# EAGLE design ModuleCarrier-ISM4334X-M4G-L44 (EAGLE 7.7.0)

## Sheet 1 of 2
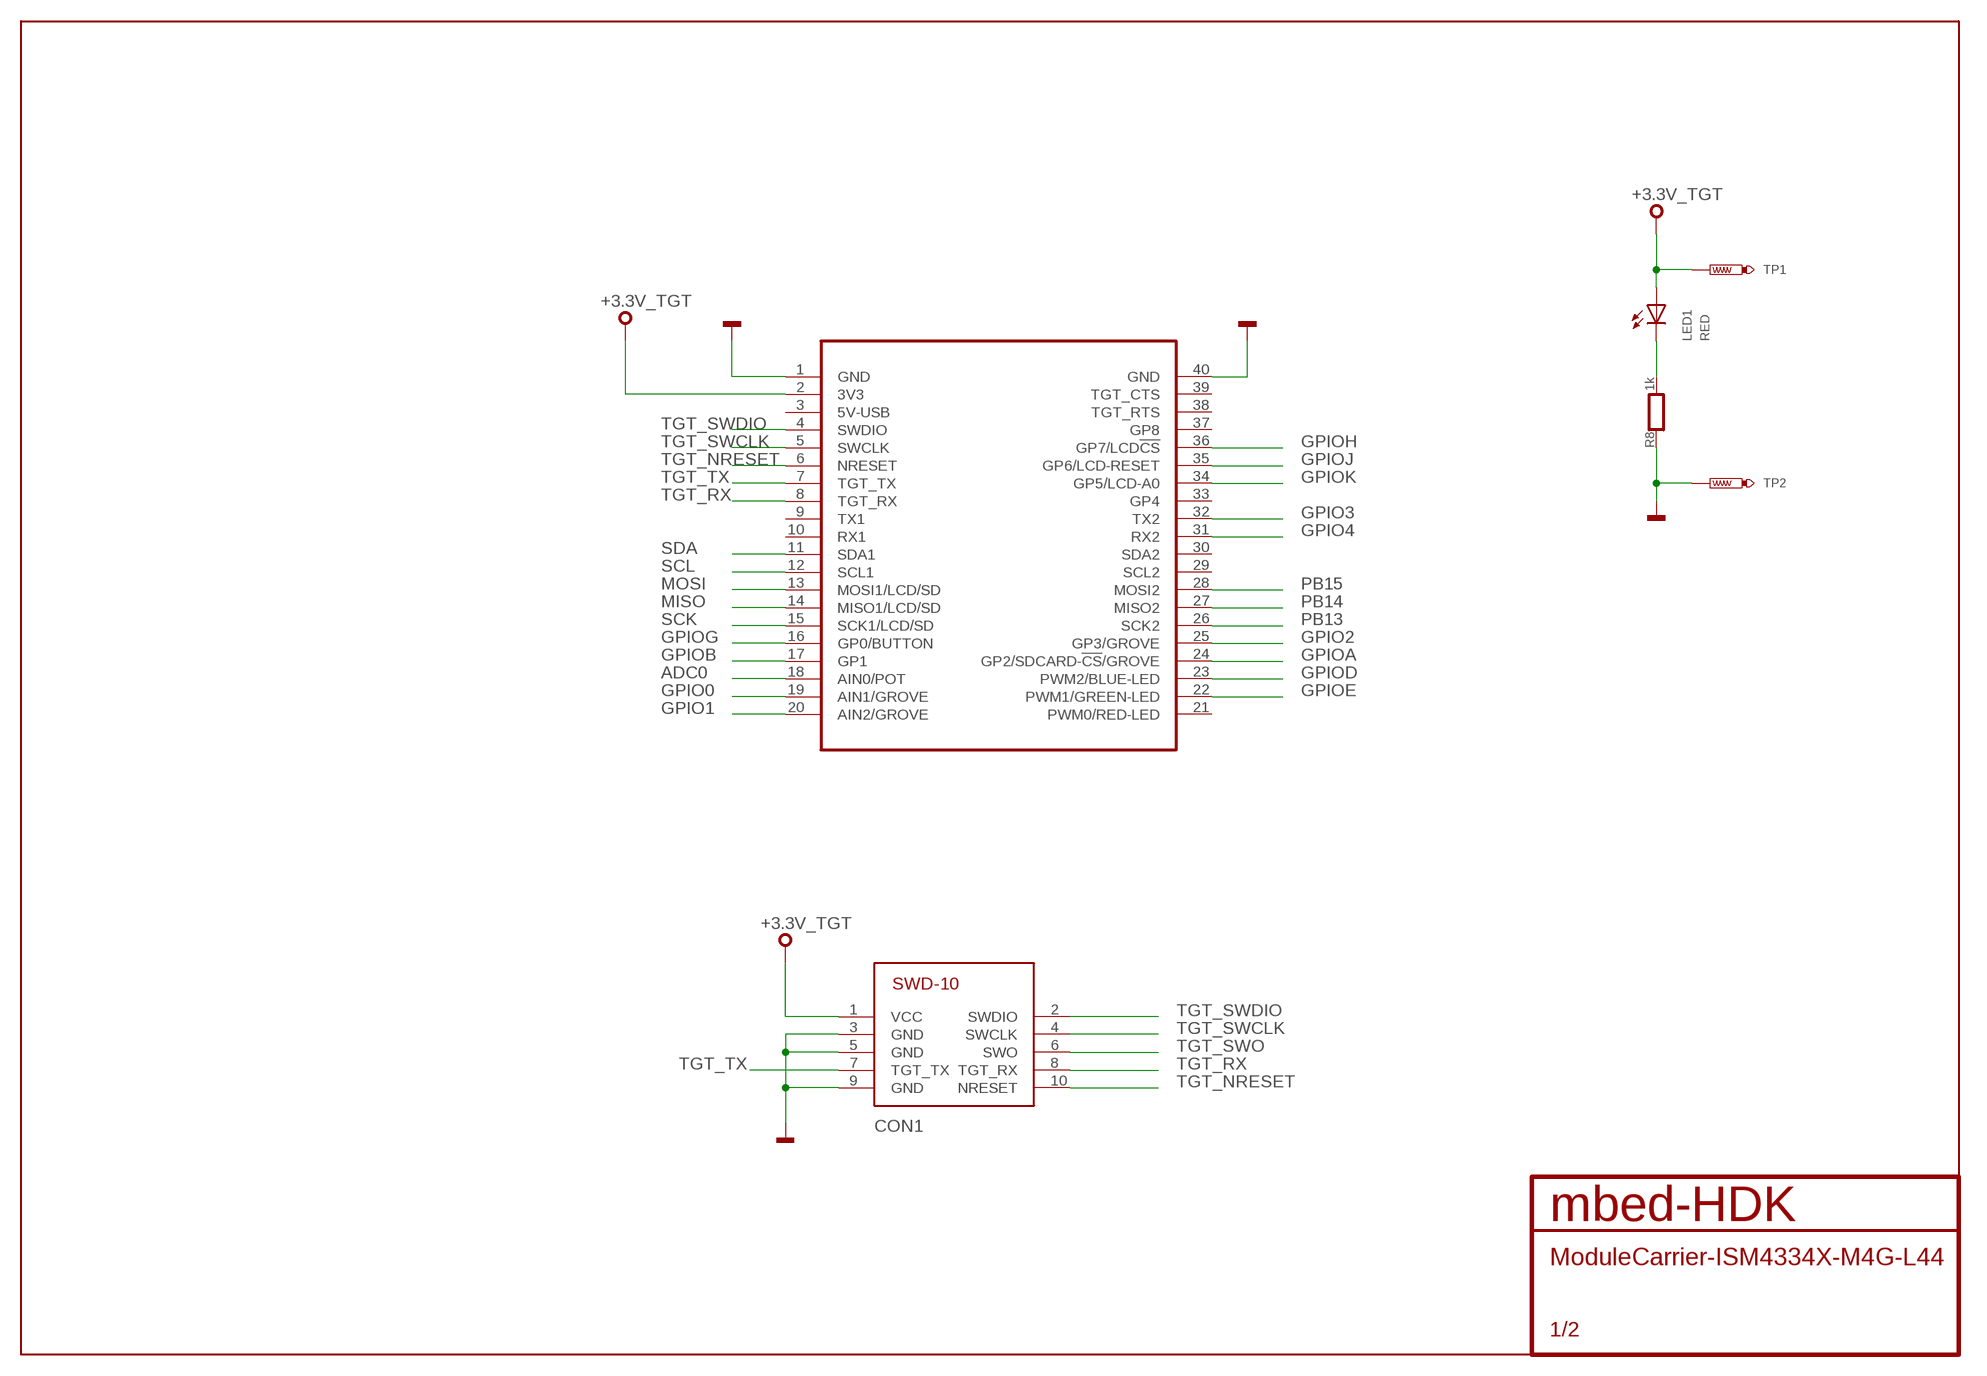
[diagram p0: schematic, sheet 1]

### Parts
CON1  SWD-10/TC2050_SMD  [FTSH-105-02]
LED1  RED  SMD_LED0603  [CHIPLED_0603]
MOD2  MODULE_DAUGHTER  [MODULE_DAUGHTER]
R8  1k  RESISTOR0603  [0603]
TP1  TEST-POINT-50R-PTH  [TP50-PTH]
TP2  TEST-POINT-50R-PTH  [TP50-PTH]

### Nets
+3.3V_TGT: CON1.1(VCC) LED1.A MOD2.2(3V3) TP1.TP ; also sheet 2
ADC0: MOD2.18(AIN0/POT) ; also sheet 2
GND: CON1.3(GND) CON1.5(GND) CON1.9(GND) MOD2.1(GND) MOD2.40(GND) R8.1 TP2.TP ; also sheet 2
GPIO0: MOD2.19(AIN1/GROVE) ; also sheet 2
GPIO1: MOD2.20(AIN2/GROVE) ; also sheet 2
GPIO2: MOD2.25(GP3/GROVE) ; also sheet 2
GPIO3: MOD2.32(TX2) ; also sheet 2
GPIO4: MOD2.31(RX2) ; also sheet 2
GPIOA: MOD2.24(GP2/SDCARD-!CS!/GROVE) ; also sheet 2
GPIOB: MOD2.17(GP1) ; also sheet 2
GPIOD: MOD2.23(PWM2/BLUE-LED) ; also sheet 2
GPIOE: MOD2.22(PWM1/GREEN-LED) ; also sheet 2
GPIOG: MOD2.16(GP0/BUTTON) ; also sheet 2
GPIOH: MOD2.36(GP7/LCD!CS) ; also sheet 2
GPIOJ: MOD2.35(GP6/LCD-RESET) ; also sheet 2
GPIOK: MOD2.34(GP5/LCD-A0) ; also sheet 2
MISO: MOD2.14(MISO1/LCD/SD) ; also sheet 2
MOSI: MOD2.13(MOSI1/LCD/SD) ; also sheet 2
PA_1: LED1.C R8.2
PB13: MOD2.26(SCK2) ; also sheet 2
PB14: MOD2.27(MISO2) ; also sheet 2
PB15: MOD2.28(MOSI2) ; also sheet 2
SCK: MOD2.15(SCK1/LCD/SD) ; also sheet 2
SCL: MOD2.12(SCL1) ; also sheet 2
SDA: MOD2.11(SDA1) ; also sheet 2
TGT_NRESET: CON1.10(NRESET) MOD2.6(NRESET) ; also sheet 2
TGT_RX: CON1.8(TGT_RX) MOD2.8(TGT_RX) ; also sheet 2
TGT_SWCLK: CON1.4(SWCLK) MOD2.5(SWCLK) ; also sheet 2
TGT_SWDIO: CON1.2(SWDIO) MOD2.4(SWDIO) ; also sheet 2
TGT_SWO: CON1.6(SWO) ; also sheet 2
TGT_TX: CON1.7(TGT_TX) MOD2.7(TGT_TX) ; also sheet 2
Unconnected: MOD2.3(5V-USB) MOD2.9(TX1) MOD2.10(RX1) MOD2.21(PWM0/RED-LED) MOD2.29(SCL2) MOD2.30(SDA2) MOD2.33(GP4) MOD2.37(GP8) MOD2.38(TGT_RTS) MOD2.39(TGT_CTS)

## Sheet 2 of 2
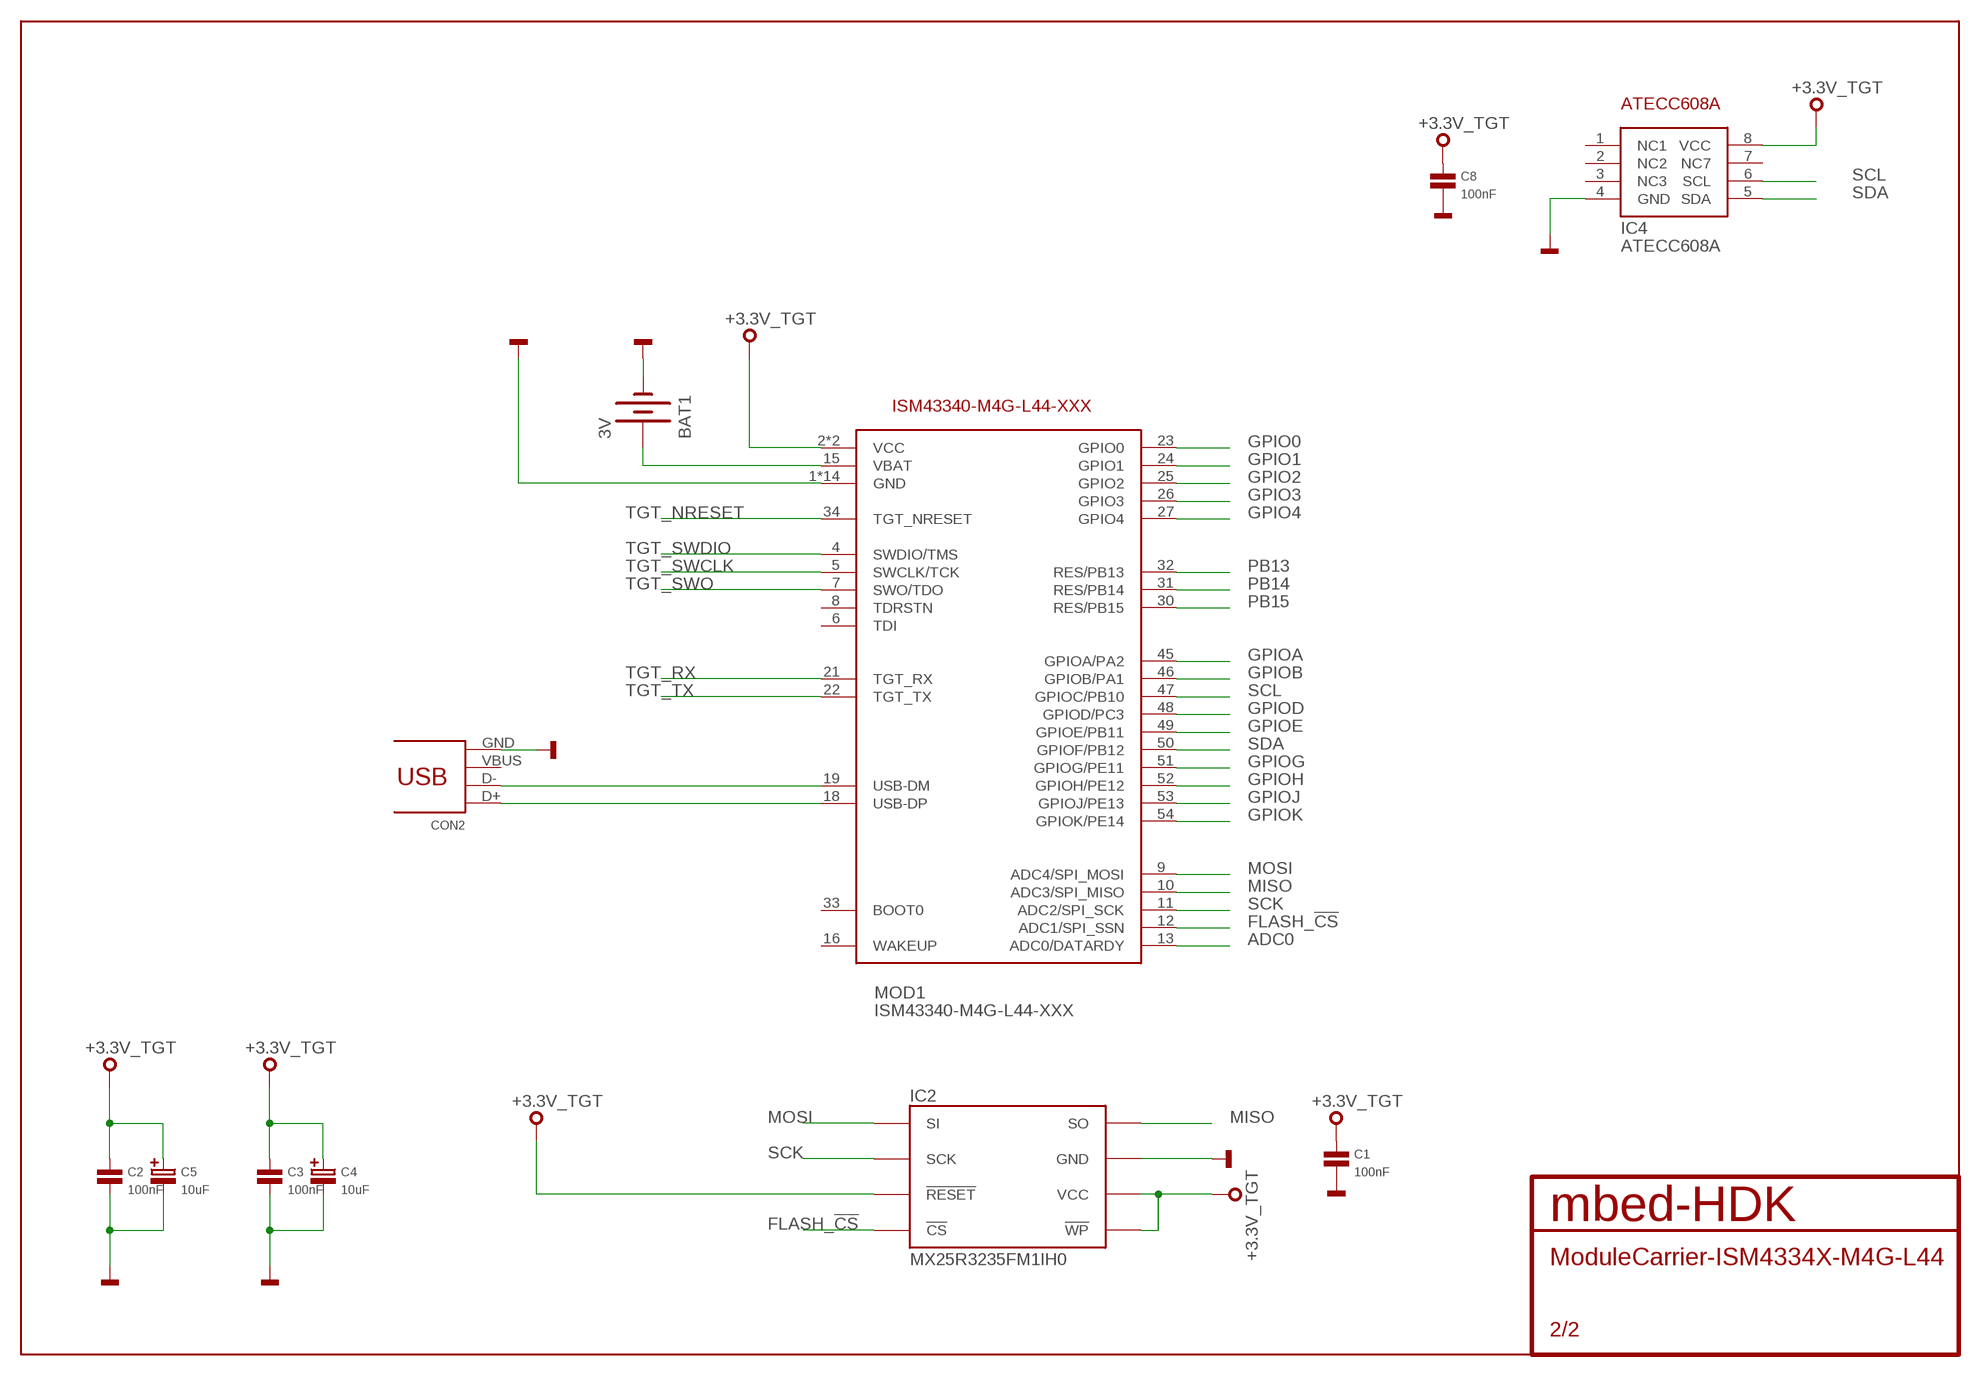
[diagram p1: schematic, sheet 2]

### Parts
BAT1  3V  BATTERY12MM  [BATTCON_12MM]
C1  100nF  CAPACITOR0603  [0603]
C2  100nF  CAPACITOR0603  [0603]
C3  100nF  CAPACITOR0603  [0603]
C4  10uF  CAPACITOR-POLARISEDB  [SMC_B]
C5  10uF  CAPACITOR-POLARISEDB  [SMC_B]
C8  100nF  CAPACITOR0603  [0603]
CON2  10033526-N3212MLF  [USB-MINI-B-H]
IC2  MX25R3235FM1IH0  [SO8]
IC4  ATECC608A  [SO8]
MOD1  ISM43340-M4G-L44-XXX  [ISM43340-M4G-L44-XXX]

### Nets
+3.3V_TGT: C1.1 C2.1 C3.1 C4.+ C5.+ C8.1 IC2.3(!WP) IC2.7(!RESET) IC2.8(VCC) IC4.8(VCC) MOD1.2(VCC) MOD1.14(VCC) ; also sheet 1
ADC0: MOD1.13(ADC0/DATARDY) ; also sheet 1
FLASH_!CS: IC2.1(!CS) MOD1.12(ADC1/SPI_SSN)
GND: BAT1.GND(-) C1.2 C2.2 C3.2 C4.- C5.- C8.2 CON2.GND IC2.4(GND) IC4.4(GND) MOD1.1(GND) MOD1.3(GND) MOD1.17(GND) MOD1.20(GND) MOD1.35(GND) MOD1.36(GND) MOD1.37(GND) MOD1.38(GND) MOD1.39(GND) MOD1.40(GND) MOD1.41(GND) MOD1.42(GND) MOD1.43(GND) MOD1.44(GND) ; also sheet 1
GPIO0: MOD1.23(GPIO0) ; also sheet 1
GPIO1: MOD1.24(GPIO1) ; also sheet 1
GPIO2: MOD1.25(GPIO2) ; also sheet 1
GPIO3: MOD1.26(GPIO3) ; also sheet 1
GPIO4: MOD1.27(GPIO4) ; also sheet 1
GPIOA: MOD1.45(GPIOA/PA2) ; also sheet 1
GPIOB: MOD1.46(GPIOB/PA1) ; also sheet 1
GPIOD: MOD1.48(GPIOD/PC3) ; also sheet 1
GPIOE: MOD1.49(GPIOE/PB11) ; also sheet 1
GPIOG: MOD1.51(GPIOG/PE11) ; also sheet 1
GPIOH: MOD1.52(GPIOH/PE12) ; also sheet 1
GPIOJ: MOD1.53(GPIOJ/PE13) ; also sheet 1
GPIOK: MOD1.54(GPIOK/PE14) ; also sheet 1
MISO: IC2.2(SO) MOD1.10(ADC3/SPI_MISO) ; also sheet 1
MOSI: IC2.5(SI) MOD1.9(ADC4/SPI_MOSI) ; also sheet 1
N$1: CON2.D+ MOD1.18(USB-DP)
N$2: CON2.D- MOD1.19(USB-DM)
N$3: BAT1.PWR@1(+) MOD1.15(VBAT)
PB13: MOD1.32(RES/PB13) ; also sheet 1
PB14: MOD1.31(RES/PB14) ; also sheet 1
PB15: MOD1.30(RES/PB15) ; also sheet 1
SCK: IC2.6(SCK) MOD1.11(ADC2/SPI_SCK) ; also sheet 1
SCL: IC4.6(SCL) MOD1.47(GPIOC/PB10) ; also sheet 1
SDA: IC4.5(SDA) MOD1.50(GPIOF/PB12) ; also sheet 1
TGT_NRESET: MOD1.34(TGT_NRESET) ; also sheet 1
TGT_RX: MOD1.21(TGT_RX) ; also sheet 1
TGT_SWCLK: MOD1.5(SWCLK/TCK) ; also sheet 1
TGT_SWDIO: MOD1.4(SWDIO/TMS) ; also sheet 1
TGT_SWO: MOD1.7(SWO/TDO) ; also sheet 1
TGT_TX: MOD1.22(TGT_TX) ; also sheet 1
Unconnected: CON2.VBUS IC4.1(NC1) IC4.2(NC2) IC4.3(NC3) IC4.7(NC7) MOD1.6(TDI) MOD1.8(TDRSTN) MOD1.16(WAKEUP) MOD1.33(BOOT0)

## Library data of the parts
BAT1 = SparkFun-Electromechanical:BATTERY: Battery Holders Various common sizes : AA, AAA, 18650 (PRT-12895), 20mm coin cell and 12mm coin cell. 20MM_4LEGS, BATT-10373; PROD_ID: BATT-08044
C1-C3 C8 = mbed-HDK-RLC:CAPACITOR: Capacitor
C4 C5 = mbed-HDK-RLC:CAPACITOR-POLARISED: Polarised capacitor; MF: Kemet; MFN: T491B106K020AT; OC-DIGIKEY: 399-8298-1-ND; OC-MOUSER: 80-T491B106K020; OC-NEWARK: 57K1740
CON1 = mbed-HDK-Connector:SWD-10/TC2050: 1mm pitch 10-Pin Cortex Programming Header with optional TC2050 footprint solderless interchangeable
CON2 = mbed-HDK-Connector:10033526-N3212MLF: USB Receptacle Horizontal Mini Type B; MF: Amphenol FCI; MFN: 10033526-N3212MLF; OC-DIGIKEY: 609-4701-1-ND; OC-MOUSER: 649-10033526N3212MLF; OC-NEWARK: 14N2224
IC2 = blackbriar:MX25R3235FM1IH0: Serial Flash 32 Mb 80 Mhz; MF: Macronix; MFN: MX25R3235FM2IH0; OC-DIGIKEY: 1092-1174-ND
IC4 = blackbriar:ATECC608A
LED1 = mbed-HDK-Optical:SMD_LED: LED SMD, Colour Red; MF: Wurth Electronics Inc; MFN: 150060RS75000; OC-DIGIKEY: 732-4978-1-ND; OC-MOUSER: 710-150060RS75000; OC-NEWARK: 2322071
MOD1 = blackbriar:ISM43340-M4G-L44-XXX
MOD2 = blackbriar:MODULE_DAUGHTER
R8 = mbed-HDK-RLC:RESISTOR: Resistor
TP1 TP2 = mbed-HDK:TEST-POINT

## Board
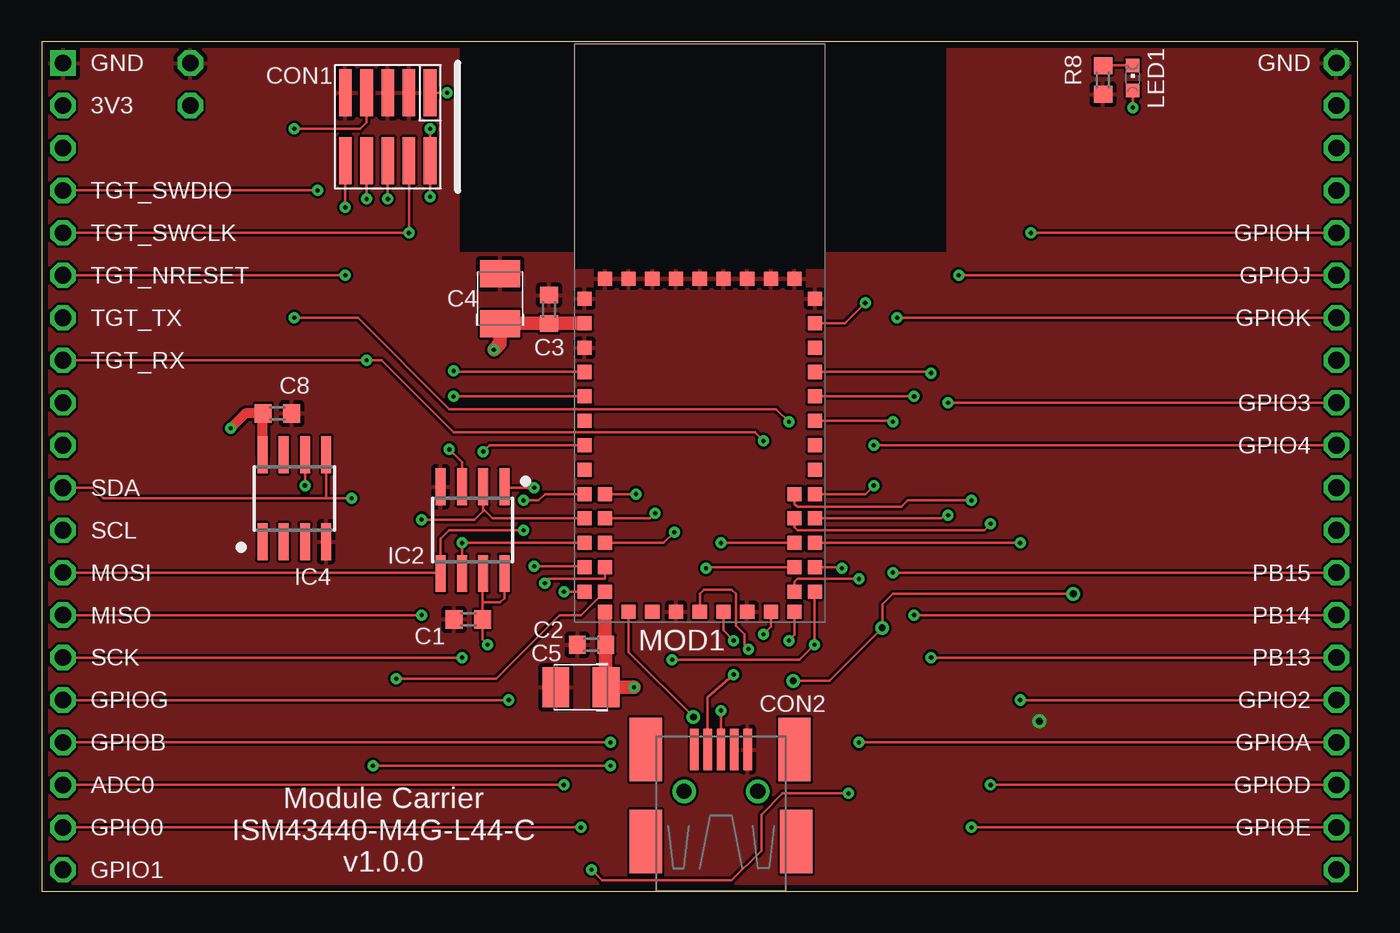
[diagram p2: board, top side]
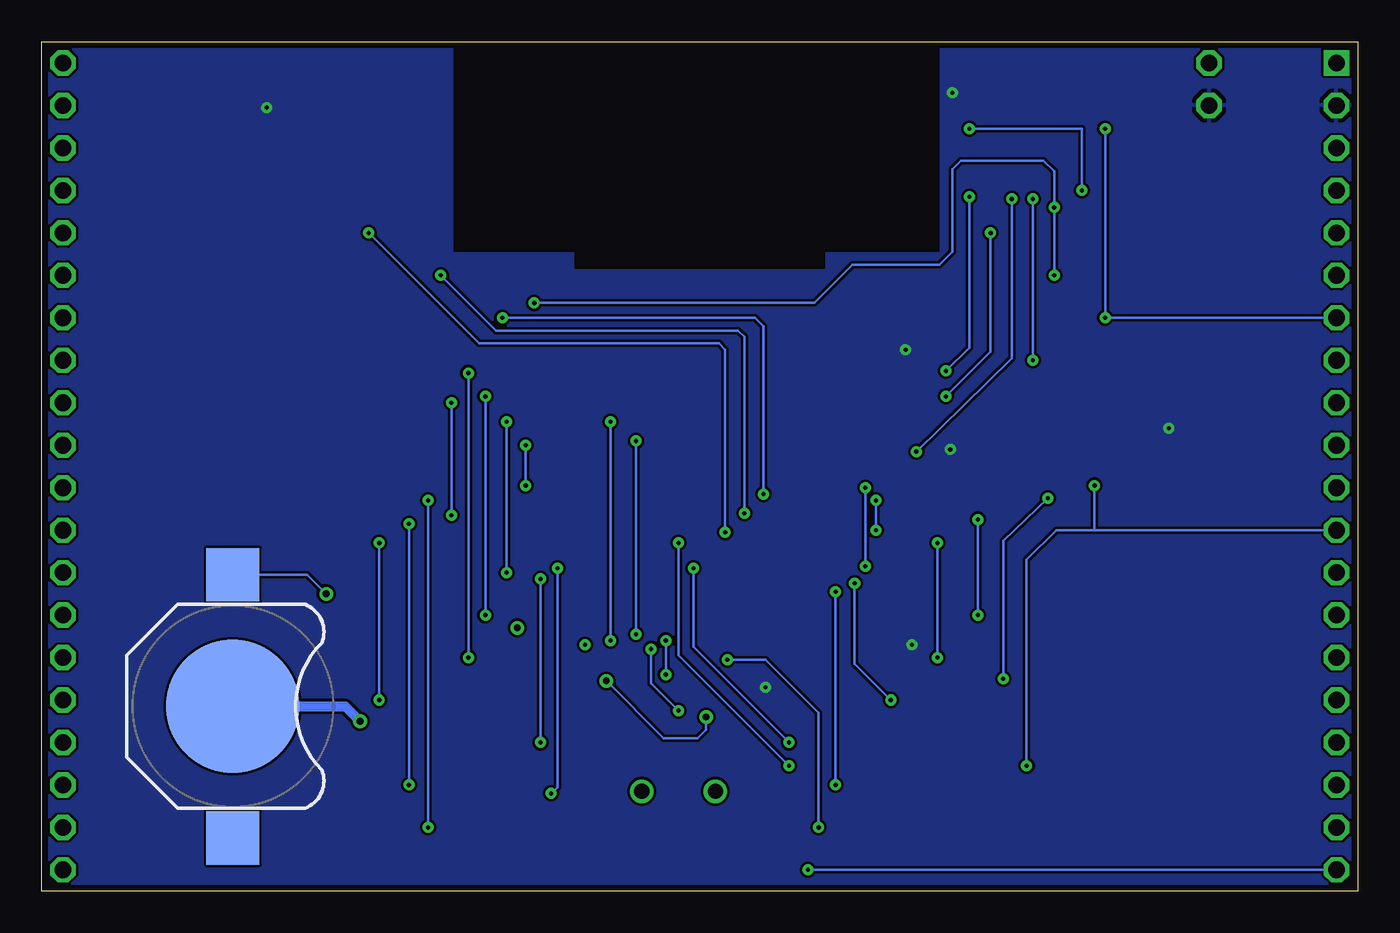
[diagram p3: board, bottom side, seen from below]

Size 78.74 x 50.8 mm. Coordinates in mm from the lower left corner, seen from the top.
Copper layers ((1*16)): Top 0.035mm / dielectric 0.8mm / Bottom 0.035mm
Design rules "mbed-HDK-6-6-2-layer": minimum track width 6mil, minimum drill 9mil, track to track 6mil, track to pad 6mil, pad to pad 6mil, via to via 6mil, smd to smd 6mil, copper to edge 15mil, drill to drill 8mil, minimum pad ring 10mil, minimum via ring 8mil, stop-mask expansion 4mil, vias tented up to drill 0mil, thermal gap 10mil
tRestrict: area 25,38.2 to 54.1,50.8
bRestrict: area 25,38.2 to 54.1,50.8

### Footprints (pad centres in the part's own frame; a part is rotated, then mirrored left to right if it is on the bottom)
BATTCON_12MM = smd 8 x 8: GND 0,0 | smd 3.175 x 3.175: PWR@1 -7.874,0; PWR@2 7.874,0
0603 = smd 1 x 1.1: 1 -0.85,0; 2 0.85,0
SMC_B = smd 1.6 x 2.4: + -1.5,0; - 1.5,0
FTSH-105-02 = smd 0.762 x 2.794: 1 0.381,-2.032; 2 0.381,2.032; 3 1.651,-2.032; 4 1.651,2.032; 5 2.921,-2.032; 6 2.921,2.032; 7 4.191,-2.032; 8 4.191,2.032; 9 5.461,-2.032; 10 5.461,2.032
USB-MINI-B-H = smd 2.5 x 0.5: D+ 2.5,0; D- 2.5,0.8; GND 2.5,-1.6; ID 2.5,-0.8; VBUS 2.5,1.6 | smd 3.81 x 1.93: GND@1 -3,4.5; GND@2 2.5,4.5; GND@3 -3,-4.5; GND@4 2.5,-4.4 | drill 0.9: P$5 0,2.2; P$6 0,-2.2
SO8 = smd 0.6 x 2.2: 1 -1.905,-2.6; 2 -0.635,-2.6; 3 0.635,-2.6; 4 1.905,-2.6; 5 1.905,2.6; 6 0.635,2.6; 7 -0.635,2.6; 8 -1.905,2.6
CHIPLED_0603 = smd 0.8 x 0.8: A 0,-0.75; C 0,0.75
ISM43340-M4G-L44-XXX = smd 0.84 x 0.84: 1 8.76,6.88; 2 7.3,6.88; 3 5.84,6.88; 4 4.38,6.88; 5 2.92,6.88; 6 1.46,6.88; 7 0,6.88; 8 -1.46,6.88; 9 -2.92,6.88; 10 -4.38,6.88; 11 -5.84,6.88; 12 -7.3,6.88; 13 -8.76,6.88; 14 -9.96,5.68; 15 -9.96,4.26; 16 -9.96,2.84; 17 -9.96,1.42; 18 -9.96,0; 19 -9.96,-1.42; 20 -9.96,-2.84; 21 -9.96,-4.26; 22 -9.96,-5.68; 23 -8.76,-6.88; 24 -7.3,-6.88; 25 -5.84,-6.88; 26 -4.38,-6.88; 27 -2.92,-6.88; 28 -1.46,-6.88; 29 0,-6.88; 30 1.46,-6.88; 31 2.92,-6.88; 32 4.38,-6.88; 33 5.84,-6.88; 34 7.3,-6.88; 35 8.76,-6.88; 36 9.96,-5.68; 37 9.96,-4.26; 38 9.96,-2.84; 39 9.96,-1.42; 40 9.96,0; 41 9.96,1.42; 42 9.96,2.84; 43 9.96,4.26; 44 9.96,5.68; 45 -8.76,-5.68; 46 -7.3,-5.68; 47 -5.84,-5.68; 48 -4.38,-5.68; 49 -2.92,-5.68; 50 -8.76,5.68; 51 -7.3,5.68; 52 -5.84,5.68; 53 -4.38,5.68; 54 -2.92,5.68
MODULE_DAUGHTER = drill 1 square: 1 0,0 | drill 1 octagon: 2 0,-2.54; 3 0,-5.08; 4 0,-7.62; 5 0,-10.16; 6 0,-12.7; 7 0,-15.24; 8 0,-17.78; 9 0,-20.32; 10 0,-22.86; 11 0,-25.4; 12 0,-27.94; 13 0,-30.48; 14 0,-33.02; 15 0,-35.56; 16 0,-38.1; 17 0,-40.64; 18 0,-43.18; 19 0,-45.72; 20 0,-48.26; 21 76.2,-48.26; 22 76.2,-45.72; 23 76.2,-43.18; 24 76.2,-40.64; 25 76.2,-38.1; 26 76.2,-35.56; 27 76.2,-33.02; 28 76.2,-30.48; 29 76.2,-27.94; 30 76.2,-25.4; 31 76.2,-22.86; 32 76.2,-20.32; 33 76.2,-17.78; 34 76.2,-15.24; 35 76.2,-12.7; 36 76.2,-10.16; 37 76.2,-7.62; 38 76.2,-5.08; 39 76.2,-2.54; 40 76.2,0
TP50-PTH = drill 1 octagon: TP 0,0

### Placement (x,y rotation side)
BAT1  67.31,11.05 270 bottom
C1  25.53,16.26 180 top
C2  32.89,14.73 180 top
C3  30.35,34.8 90 top
C4  27.43,35.43 90 top
C5  32.26,12.19 180 top
C8  14.1,28.58 0 top
CON1  23.62,45.72 180 top
CON2  40.64,5.97 90 top
IC2  25.78,21.59 180 top
IC4  15.11,23.5 0 top
LED1  65.28,48.64 0 top
MOD1  39.37,26.67 90 top
MOD2  1.27,49.53 0 top
R8  63.5,48.51 90 top
TP1  8.89,46.99 0 top
TP2  8.89,49.53 0 top

### Tracks (layer width: path | path; a pad name or v marks a point on that pad's centre or on a via)
+3.3V_TGT  (via drill 0.25)
  Top 0.152: v26.67,14.73 26.38,15.07 C1.1 26.38,17.27 | 26.38,17.27 26.38,18.95 IC2.7 | IC2.8 27.69,17.53 27.43,17.27 26.38,17.27 | CON1.1 v24.26,47.75 | LED1.A v65.28,46.86 | IC2.3 25.15,25.65 v24.38,26.42
  Top 0.61: v11.3,27.69 12.19,28.58 C8.1 13.21,28.54 IC4.8
  Top 0.813: MOD1.14 33.69,14.79 C2.1 33.74,12.21 C5.+ v35.43,12.19 | MOD1.2 30.38,33.97 | 30.38,33.97 C3.1 | 30.38,33.97 27.47,33.97 C4.+ 27.43,32.77 v27.05,32.39
  pour Bottom: 0,50.8 78.74,50.8 78.74,0 0,0
ADC0  (via drill 0.25)
  Top 0.152: MOD1.13 v31.25,17.91 v31.24,17.91 | v31.24,6.35 MOD2.18
  Bottom 0.152: v31.24,17.91 v31.24,6.35
FLASH_!CS  (via drill 0.25)
  Top 0.152: v29.46,24.13 27.75,24.13 IC2.1 | v29.46,19.43 32.43,19.43 MOD1.12
  Bottom 0.152: v29.46,19.43 v29.46,24.13
GND  (via drill 0.41)
  Bottom 0.61: BAT1.GND 60.58,11.05 v59.69,10.16
  pour Top: 0,50.8 78.74,50.8 78.74,0 0,0
GPIO0  (via drill 0.25)
  Top 0.152: MOD1.23 46.23,17.78 v46.23,14.73 45.34,13.84 v37.72,13.84 | MOD2.19 v32.26,3.81
  Bottom 0.152: v32.26,3.81 32.26,10.67 35.43,13.84 v37.72,13.84
GPIO1  (via drill 0.25)
  Top 0.152: MOD1.24 47.82,19.37 v47.88,19.3 | v32.89,1.27 33.53,0.63 41.28,0.63 43.05,2.41 43.05,4.57 44.32,5.84 v48.26,5.84
  Bottom 0.152: MOD2.20 v32.89,1.27 | v48.26,5.84 47.88,6.22 v47.88,19.3
GPIO2  (via drill 0.25)
  Top 0.152: MOD1.25 v58.55,20.83 | v58.55,11.43 MOD2.25
  Bottom 0.152: v58.55,20.83 v58.55,11.43
GPIO3  (via drill 0.25)
  Top 0.152: MOD1.26 53.79,22.29 v54.23,22.48 | v54.23,29.21 MOD2.32
  Bottom 0.152: v54.23,22.48 v54.23,29.21
GPIO4  (via drill 0.25)
  Top 0.152: MOD1.27 47.75,23.75 49.28,23.75 v49.78,24.26 | v49.78,26.67 MOD2.31
  Bottom 0.152: v49.78,24.26 v49.78,26.67
GPIOA  (via drill 0.25)
  Top 0.152: MOD1.45 45.05,18.51 45.21,18.67 v48.9,18.67 | v48.9,8.89 MOD2.24
  Bottom 0.152: v48.9,18.67 v48.9,8.89
GPIOB  (via drill 0.25)
  Top 0.152: MOD1.46 39.82,19.37 v39.75,19.3 | v34.04,8.89 MOD2.17
  Bottom 0.152: v39.75,19.3 39.75,14.61 v34.04,8.89
GPIOD  (via drill 0.25)
  Top 0.152: MOD1.48 45.05,21.75 45.21,21.59 56.39,21.59 v56.77,21.97 | v56.77,6.35 MOD2.23
  Bottom 0.152: v56.77,21.97 v56.77,6.35
GPIOE  (via drill 0.25)
  Top 0.152: MOD1.49 45.05,23.15 45.21,22.99 51.44,22.99 51.82,23.37 v55.63,23.37 | v55.63,3.81 MOD2.22
  Bottom 0.152: v55.63,23.37 v55.63,3.81
GPIOG  (via drill 0.25)
  Top 0.152: MOD1.51 33.69,18.7 33.66,18.67 30.35,18.67 v30.1,18.42 | v27.94,11.43 MOD2.16
  Bottom 0.152: v30.1,18.42 30.1,13.59 v27.94,11.43
GPIOH  (via drill 0.25)
  Top 0.152: MOD1.52 37.21,20.83 v37.85,21.46 | v59.18,39.37 MOD2.36
  Bottom 0.152: v37.85,21.46 37.85,32.39 38.23,32.77 52.58,32.77 v59.18,39.37
GPIOJ  (via drill 0.25)
  Top 0.152: MOD1.53 36.39,22.29 v36.7,22.61 | v54.86,36.83 MOD2.35
  Bottom 0.152: v36.7,22.61 36.7,33.15 37.08,33.53 51.56,33.53 v54.86,36.83
GPIOK  (via drill 0.25)
  Top 0.152: MOD1.54 v35.56,23.75 | v51.18,34.29 MOD2.34
  Bottom 0.152: v35.56,23.75 35.56,33.78 36.07,34.29 v51.18,34.29
MISO  (via drill 0.25)
  Top 0.152: IC2.2 26.42,22.86 | 26.42,22.86 26.99,22.29 MOD1.10 | 26.42,22.86 26.42,22.73 25.91,22.23 v22.73,22.23 | v22.73,16.51 MOD2.14
  Bottom 0.152: v22.73,22.23 v22.73,16.51
MOSI  (via drill 0.25)
  Top 0.152: MOD1.9 30.1,23.75 29.72,23.37 v28.83,23.37 | v28.83,21.59 24.38,21.59 23.88,21.08 IC2.5 23.82,19.05 MOD2.13
  Bottom 0.152: v28.83,23.37 v28.83,21.59
N$1  (via drill 0.25)
  Top 0.152: MOD1.18 39.37,17.78 39.62,18.03 41.28,18.03 41.53,17.78 41.53,15.88 42.04,15.37 42.04,14.73 v42.29,14.48 | CON2.D+ v40.64,10.8
  Bottom 0.152: v42.29,14.48 42.29,12.45 v40.64,10.8
N$2  (via drill 0.25)
  Top 0.152: v41.4,12.95 39.84,11.59 CON2.D- | MOD1.19 40.79,15.6 v41.4,14.99
  Bottom 0.152: v41.4,14.99 v41.4,12.95
N$3  (via drill 0.41)
  Top 0.152: MOD1.15 35.11,14.29 v38.99,10.41 | v44.96,12.57 47.12,12.57 v50.29,15.75 50.29,17.15 50.93,17.78 v61.72,17.78
  Bottom 0.152: v38.99,10.41 38.99,9.65 39.5,9.14 41.53,9.14 v44.96,12.57 | v61.72,17.78 62.87,18.92 BAT1.PWR@1
PA_1
  Top 0.152: R8.2 63.65,49.39 LED1.C
PB13  (via drill 0.25)
  Top 0.152: MOD1.32 53.15,31.05 v53.21,30.99 | v53.21,13.97 MOD2.26
  Bottom 0.152: v53.21,30.99 v53.21,13.97
PB14  (via drill 0.25)
  Top 0.152: MOD1.31 v52.2,29.59 | v52.2,16.51 MOD2.27
  Bottom 0.152: v52.2,29.59 v52.2,16.51
PB15  (via drill 0.25)
  Top 0.152: MOD1.30 50.86,28.13 v50.93,28.07 | MOD2.28 v50.93,19.05
  Bottom 0.152: v50.93,28.07 v50.93,19.05
SCK  (via drill 0.25)
  Top 0.152: MOD1.11 25.4,20.83 v25.15,20.83 IC2.6 | v25.15,13.97 MOD2.15
  Bottom 0.152: v25.15,13.97 v25.15,20.83
SCL  (via drill 0.25)
  Top 0.152: MOD1.47 42.93,20.83 v40.64,20.83 | v34.04,7.49 v19.81,7.49 | IC4.6 v15.75,24.26
  Bottom 0.152: v40.64,20.83 40.64,14.1 v34.04,7.49 | v19.81,7.49 19.81,19.81 18.03,21.59 15.75,21.59 | MOD2.12 15.75,21.59 | v15.75,24.26 15.75,21.59
SDA  (via drill 0.25)
  Top 0.152: MOD2.11 3.05,24.13 3.68,23.5 17.02,23.5 | 17.02,23.5 v18.54,23.5 | IC4.5 17.02,23.5 | MOD1.50 33.66,17.91 32.26,16.51 30.99,16.51 27.18,12.7 v21.21,12.7
  Bottom 0.152: v21.21,12.7 21.21,20.96 v18.54,23.5
TGT_NRESET  (via drill 0.25)
  Top 0.152: MOD1.34 48.07,33.97 v49.28,35.18 | v18.16,40.89 CON1.10 | MOD2.6 v18.16,36.83
  Bottom 0.152: v49.28,35.18 32.51,35.18 30.23,37.47 25.02,37.47 24.26,38.23 24.26,43.18 23.75,43.69 18.8,43.69 18.16,43.05 v18.16,40.89 v18.16,36.83
TGT_RX  (via drill 0.25)
  Top 0.152: MOD1.21 43.63,15.82 v43.18,15.37 | MOD2.8 v19.43,31.75 20.32,31.75 24.64,27.43 42.67,27.43 v43.18,26.92 | CON1.8 v19.43,41.4
  Bottom 0.152: v19.43,41.4 v19.43,31.75 | v43.18,26.92 v43.18,15.37
TGT_SWCLK  (via drill 0.25)
  Top 0.152: CON1.4 v21.97,39.37 MOD2.5 | v24.64,29.59 MOD1.5
  Bottom 0.152: v21.97,39.37 21.97,32.26 v24.64,29.59
TGT_SWDIO  (via drill 0.25)
  Top 0.152: v23.24,45.59 CON1.2 v23.24,41.53 | MOD1.4 24.7,31.05 v24.64,31.12 | v16.51,41.91 MOD2.4
  Bottom 0.152: v16.51,41.91 16.51,45.59 v23.24,45.59 | v24.64,31.12 23.24,32.51 v23.24,41.53
TGT_SWO  (via drill 0.25)
  Top 0.152: MOD1.7 26.8,26.67 v26.42,26.29 | v20.7,41.4 CON1.6
  Bottom 0.152: v26.42,26.29 20.7,31.88 v20.7,41.4
TGT_TX  (via drill 0.25)
  Top 0.152: MOD1.22 45.05,15.33 v44.7,14.99 | v15.11,34.29 18.92,34.29 24.38,28.83 43.94,28.83 v44.7,28.07 | CON1.7 19.43,45.97 19.05,45.59 v15.11,45.59
  Bottom 0.152: MOD2.7 v15.11,34.29 v15.11,45.59 | v44.7,28.07 v44.7,14.99

### Text on the board
tPlace: GND / 3V3 / / TGT_SWDIO / TGT_SWCLK / TGT_NRESET / TGT_TX / TGT_RX / / / SDA / SCL / MOSI / MISO / SCK / GPIOG / GPIOB / ADC0 / GPIO0 / GPIO1 | GND / / / / GPIOH / GPIOJ / GPIOK / / GPIO3 / GPIO4 / / / PB15 / PB14 / PB13 / GPIO2 / GPIOA / GPIOD / GPIOE | Module Carrier / ISM43440-M4G-L44-C / v1.0.0